# EAGLE design wireless-dong-mk-2.3 (EAGLE 6.5.0)
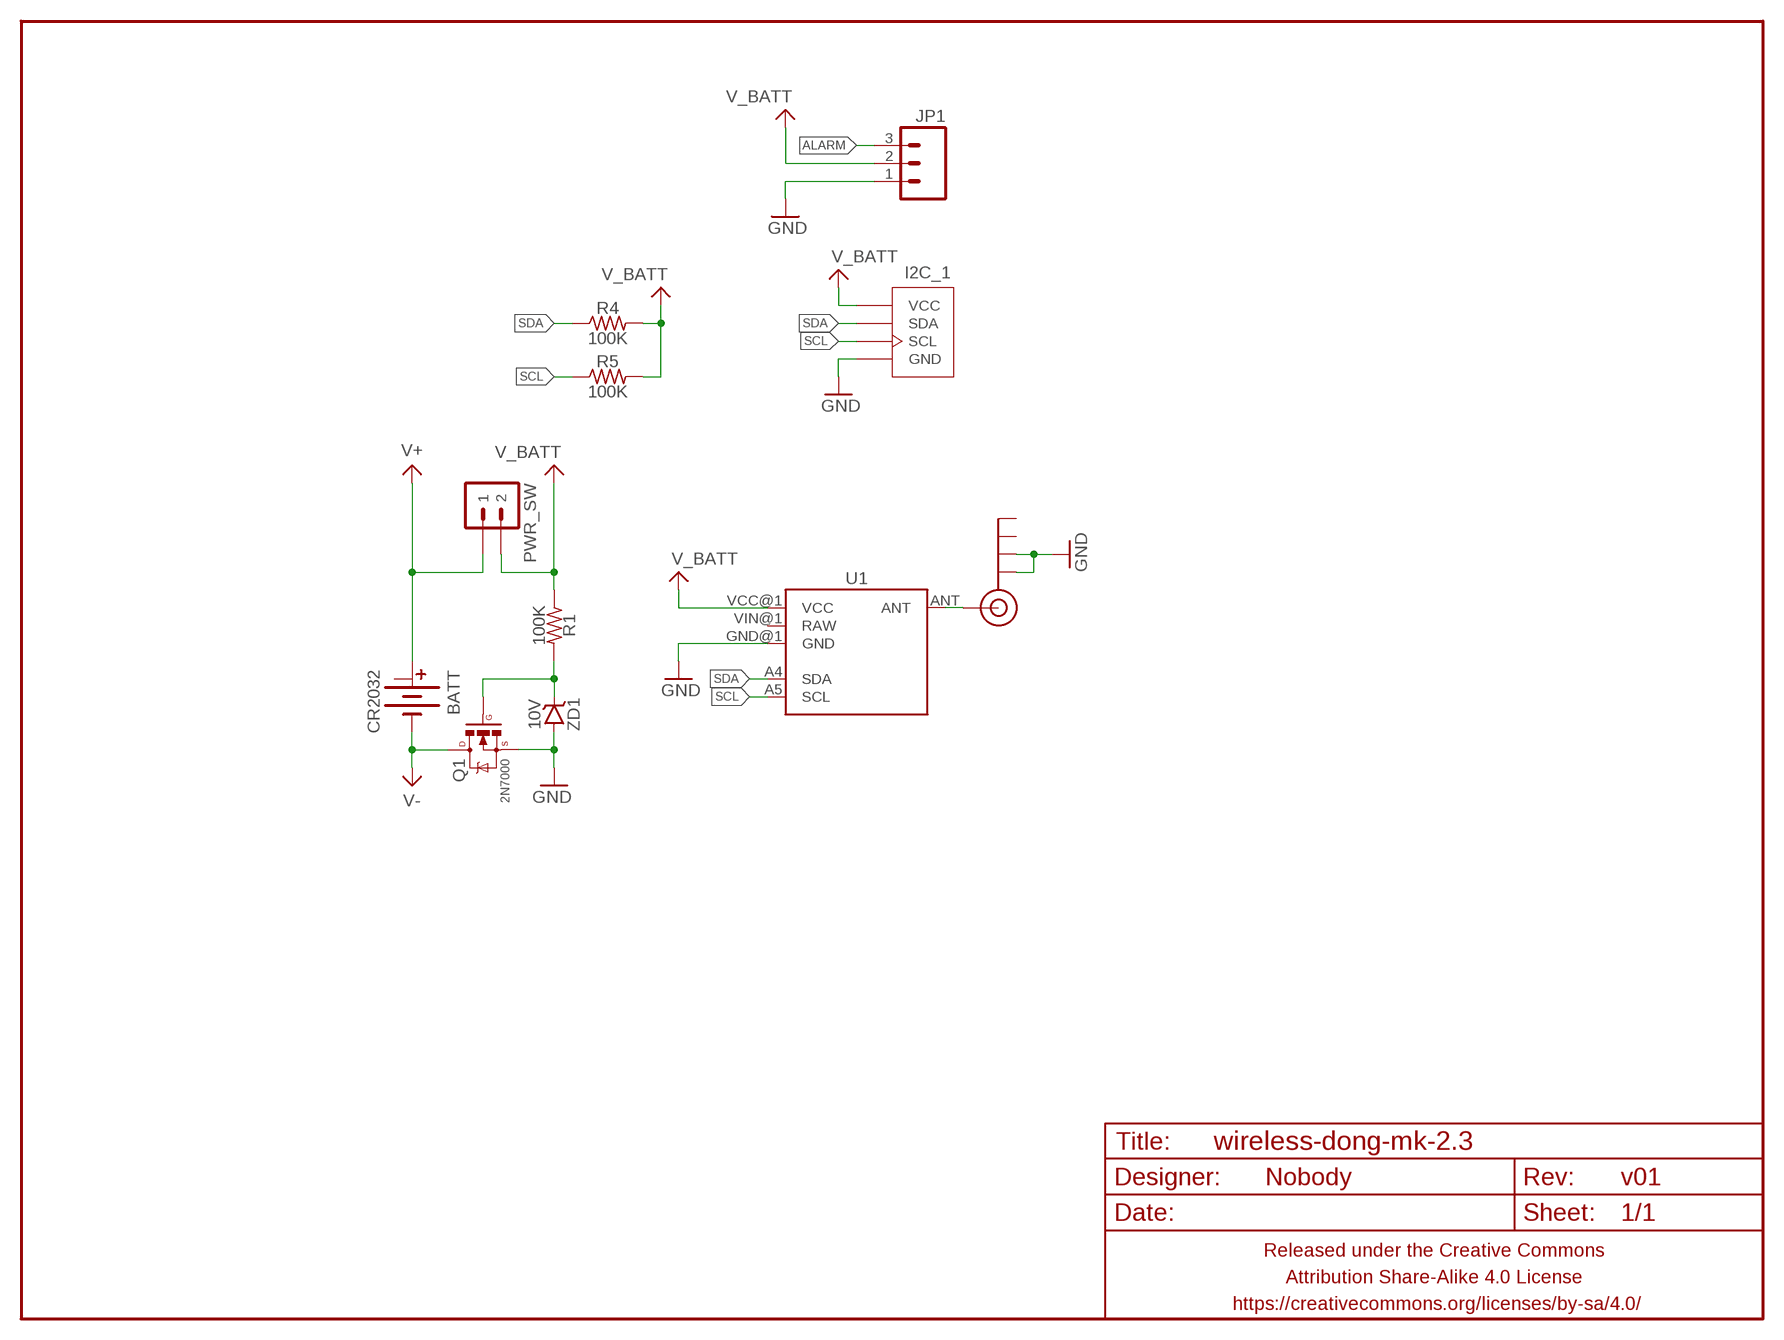
[diagram p0: schematic, sheet 1]

## Parts
ANT  SMA_EDGE  [SMA-EDGE]
BATT  CR2032  BATTERY-COINCR2032_SMD_TIGHT  [BATTCON_20MM_MINE_STAHPIT]
FRAME1  FRAME-LETTERNO_PACKAGE  [DUMMY]
I2C_1  M04-I2CJST-4-PH-RA-CENTERED  [1X04-JST-PH-RA-PTH-I2C-CENTERED]
JP1  M03JST-PTH  [JST-3-PH-RA-PTH]
PWR_SW  M02PTH-CENTERED  [1X02-CENTER]
Q1  2N7000  MOSFET-NCHANNELIRLML2502  [SOT23]
R1  100K  RESISTORR0805  [R0805]
R4  100K  RESISTORR0805  [R0805]
R5  100K  RESISTORR0805  [R0805]
U1  MOTEINO_BOAT  [MOTEINO_BOAT]
ZD1  10V  DIODE-ZENERSOT23  [SOT23]

## Nets
ALARM: JP1.3
GND: ANT.GND@0(GND) ANT.GND@1(GND) I2C_1.1(GND) JP1.1 Q1.2(S) U1.GND@1(GND) ZD1.1(A) ZD1.2(A)
N$1: Q1.1(G) R1.2 ZD1.3(C)
N$2: ANT.SIG(SIGNAL) U1.ANT
SCL: I2C_1.4(SCL) R5.1 U1.A5(SCL)
SDA: I2C_1.3(SDA) R4.1 U1.A4(SDA)
V+: BATT.TOP@1(+) PWR_SW.1
V-: BATT.BOTTOM(-) Q1.3(D)
V_BATT: I2C_1.2(VCC) JP1.2 PWR_SW.2 R1.1 R4.2 R5.2 U1.VCC@1(VCC)
Unconnected: ANT.GND@2(GND) ANT.GND@3(GND) BATT.TOP@2(+1) U1.VIN@1(RAW)

## Library data of the parts
ANT = A_butts:SMA_EDGE: SMA Antenna Connector End launch SMA connector. The paste layer has been removed so that the connector can be hand soldered onto the board after reflow.
BATT = A_butts:BATTERY-COIN
FRAME1 = A_butts:FRAME-LETTER: Schematic Frame Standard 8.5x11 US Letter frame; DESIGNER: Nobody; VERSION: v01
I2C_1 = A_butts:M04-I2C
JP1 = A_butts:M03: Header 3 Standard 3-pin 0.1" header. Use with straight break away headers (SKU : PRT-00116), right angle break away headers (PRT-00553), swiss pins (PRT-00743), machine pins (PRT-00117), and female headers (PRT-00115). Molex polarized connector foot print use with SKU : PRT-08232 with associated crimp pins and housings.; SKU: PRT-09915
PWR_SW = A_butts:M02: Standard 2-pin 0.1" header. Use with - straight break away headers ( PRT-00116) - right angle break away headers (PRT-00553) - swiss pins (PRT-00743) - machine pins (PRT-00117) - female headers (PRT-00115) Molex polarized connector foot print use with: PRT-08233 with associated crimp pins and housings. 2.54_SCREWTERM for use with PRT-10571. 3.5mm Screw Terminal footprints for PRT-08084 5mm Screw Terminal footprints for use with PRT-08433
Q1 = A_butts:MOSFET-NCHANNEL: Common NMOSFET Parts MFG P/N Store ID Prod ID FDD8780 TRANS-09984 SI7820DN TRANS-11055 FDS6630A IC-08089 2N7002PW TRANS-11151 FQP30N06L COM-10213 TRANS-10060 BSS123LT1G TRANS-08345 BSS138 TRANS-00830 BS170 2N7000
R1 R4 R5 = A_butts:RESISTOR: RESISTOR, American symbol
U1 = A_butts:MOTEINO_BOAT
ZD1 = A_butts:DIODE-ZENER: Zener Diode Production Part - 8199 3.4V Zener Voltage

## Board
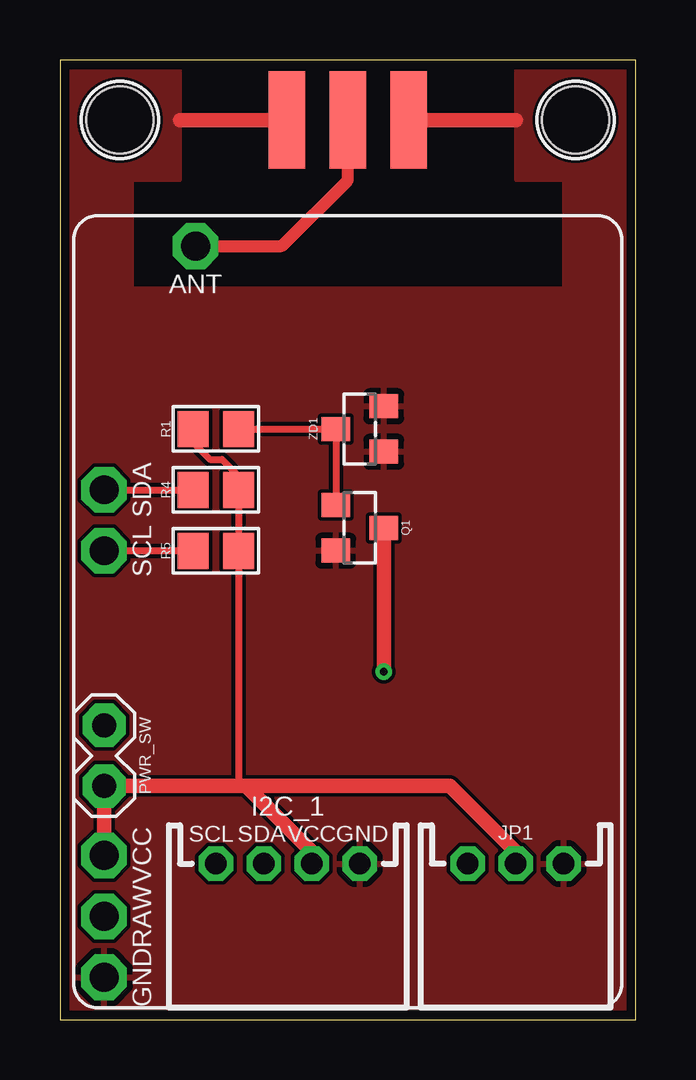
[diagram p1: board, top side]
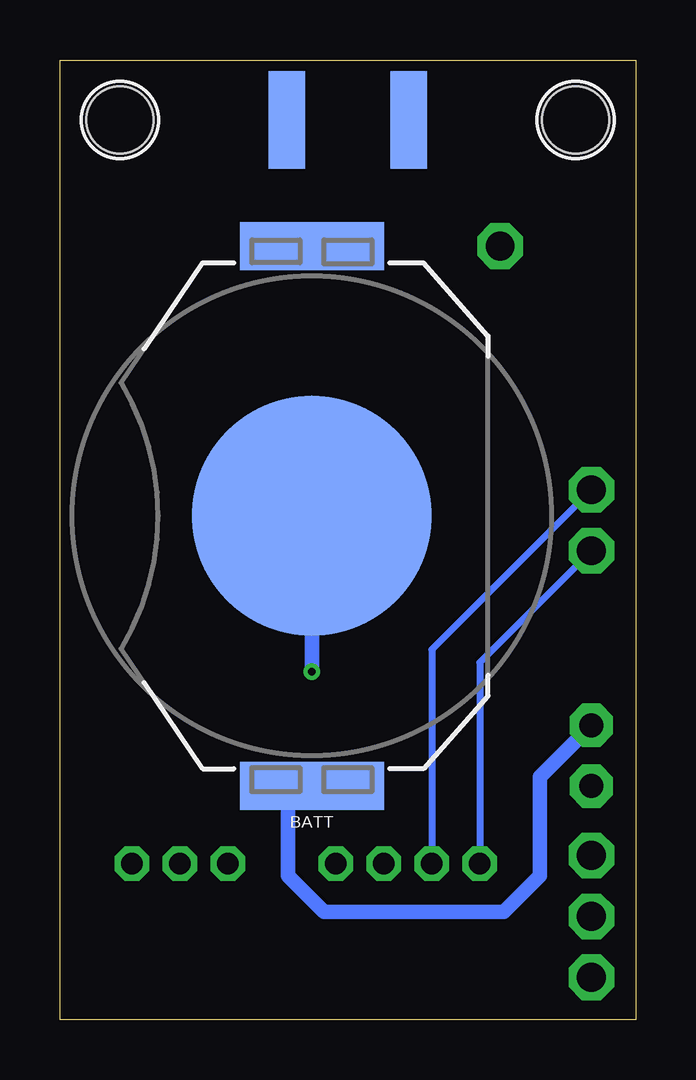
[diagram p2: board, bottom side, seen from below]

Size 24 x 40 mm. Coordinates in mm from the lower left corner, seen from the top.
Outline: 0,0 24,0 24,40 0,40 0,0
Copper layers (1*16): Top 0.0356mm / dielectric 1.5011mm / Bottom 0.0356mm
Design rules "LaenPCBOrder_2": minimum track width 6mil, minimum drill 13mil, track to track 6mil, track to pad 6mil, pad to pad 6mil, via to via 6mil, smd to smd 6mil, copper to edge 15mil, drill to drill 6mil, minimum pad ring 7mil, minimum via ring 7mil, stop-mask expansion 3mil, vias tented up to drill 20mil, thermal gap 10mil
Holes 2.8 mm at 21.5,37.5 2.5,37.5

### Footprints (pad centres in the part's own frame; a part is rotated, then mirrored left to right if it is on the bottom)
SMA-EDGE = smd 1.524 x 4.064: GND@0 -2.54,0; GND@1 2.54,0; SIG 0,0 | smd 1.524 x 4.064 bottom: GND@2 -2.54,0; GND@3 2.54,0
BATTCON_20MM_MINE_STAHPIT = smd 10 x 10: BOTTOM 0,0 | smd 6 x 2: TOP@1 0,11.25; TOP@2 0,-11.25
1X04-JST-PH-RA-PTH-I2C-CENTERED = drill 0.9 pad 1.422 octagon: 1 -3,0; 2 -1,0; 3 1,0; 4 3,0
JST-3-PH-RA-PTH = drill 0.9 pad 1.422 octagon: 1 -2,0; 2 0,0; 3 2,0
1X02-CENTER = drill 1 pad 1.8 octagon: 1 -1.27,0; 2 1.27,0
SOT23 = smd 1 x 1.2: 1 -0.95,-1; 2 0.95,-1; 3 0,1
R0805 = smd 1.3 x 1.5: 1 -0.95,0; 2 0.95,0
MOTEINO_BOAT = drill 1.2 pad 1.9 octagon: A4 10.16,-5.08; A5 10.16,-2.54; ANT 6.35,-15.24; GND@1 10.16,15.24; VCC@1 10.16,10.16; VIN@1 10.16,12.7

### Placement (x,y rotation side)
ANT  12,37.5 0 top
BATT  13.5,21 180 bottom
FRAME1  0,0 0 top
I2C_1  9.5,6.5 180 top
JP1  19,6.5 180 top
PWR_SW  1.84,11 270 top
Q1  12.5,20.5 270 top
R1  6.5,24.62 0 top
R4  6.5,22.08 0 top
R5  6.5,19.54 0 top
U1  12,17 180 top
ZD1  12.5,24.62 90 top

### Tracks (layer width: path | path; a pad name or v marks a point on that pad's centre or on a via)
GND
  Top 0.6: ANT.GND@0 5,37.5 | ANT.GND@1 19,37.5
  pour Top: -0.1,-0.1 -0.1,40 5,40 5,35 3,35 3,30.5 21,30.5 21,35 19,35 19,40 24.1,40 24.1,-0.1
N$1
  Top 0.3: R1.2 ZD1.3 Q1.1
N$2
  Top 0.5: U1.ANT 9.24,32.24 12,35 ANT.SIG
SCL
  Top 0.3: R5.1 U1.A5
  Bottom 0.3: U1.A5 6.5,14.88 I2C_1.4
SDA
  Top 0.3: U1.A4 R4.1
  Bottom 0.3: U1.A4 8.5,15.42 I2C_1.3
V+
  Bottom 0.6: BATT.TOP@1 14.5,9.75 14.5,6 13,4.5 5.5,4.5 4,6 4,10.11 PWR_SW.1
V-  (via drill 0.33)
  Top 0.6: v13.5,14.5 Q1.3
  Bottom 0.6: BATT.BOTTOM v13.5,14.5
V_BATT
  Top 0.3: R1.1 5.55,24.05 6.25,23.35 6.75,23.35 7.45,22.65 R4.2 R5.2 7.45,9.73
  Top 0.6: U1.VCC@1 PWR_SW.2 7.45,9.73 7.77,9.73 | I2C_1.2 10.5,7 7.77,9.73 | JP1.2 19,7 16.27,9.73 7.77,9.73